# Altium schematic sheet pi_connectors.SchDoc
size A; SheetNumber: 2; SheetTotal: 2
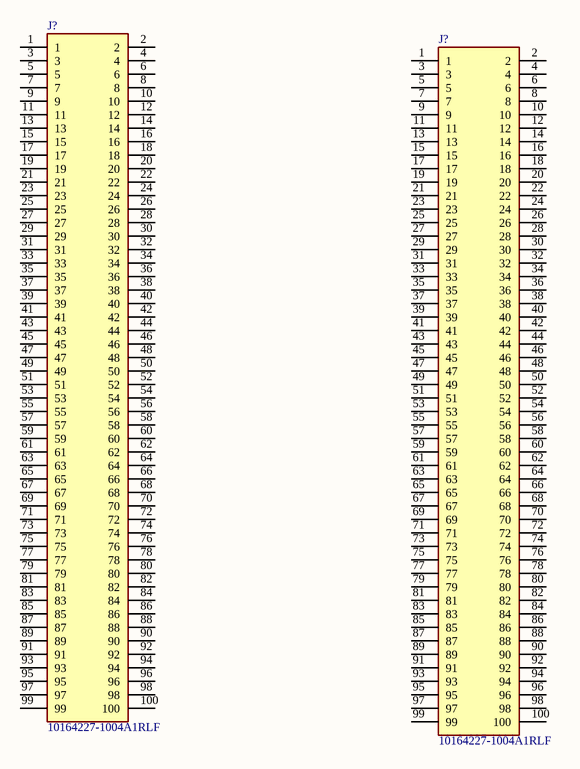
[diagram p0: pi_connectors.SchDoc]

## Parts
(Parts that share a designator on the sheet are numbered #1, #2 ... from top to bottom, then left to right.)
J?#1  10164227-1004A1RLF  [101642271004A1RLF]
J?#2  10164227-1004A1RLF  [101642271004A1RLF]

## Nets

Not connected (* = marked no-connect by the designer): J?#1 1 2 3 4 5 6 7 8 9 10 11 12 13 14 15 16 17 18 19 20 21 22 23 24 25 26 27 28 29 30 31 32 33 34 35 36 37 38 39 40 41 42 43 44 45 46 47 48 49 50 51 52 53 54 55 56 57 58 59 60 61 62 63 64 65 66 67 68 69 70 71 72 73 74 75 76 77 78 79 80 81 82 83 84 85 86 87 88 89 90 91 92 93 94 95 96 97 98 99 100; J?#2 1 2 3 4 5 6 7 8 9 10 11 12 13 14 15 16 17 18 19 20 21 22 23 24 25 26 27 28 29 30 31 32 33 34 35 36 37 38 39 40 41 42 43 44 45 46 47 48 49 50 51 52 53 54 55 56 57 58 59 60 61 62 63 64 65 66 67 68 69 70 71 72 73 74 75 76 77 78 79 80 81 82 83 84 85 86 87 88 89 90 91 92 93 94 95 96 97 98 99 100

## Library data of the parts
J?#1 J?#2 = 10164227-1004A1RLF: Connector; Manufacturer_Name: Amphenol; Description: BergStak 0.40mm; Datasheet Link: https://cdn.amphenol-cs.com/media/wysiwyg/files/drawing/10164227.pdf; Height: 4.1mm; Manufacturer_Part_Number: 10164227-1004A1RLF; Mouser Part Number: 649-101642271004RLF; Mouser Price/Stock: https://www.mouser.co.uk/ProductDetail/Amphenol-FCI/10164227-1004A1RLF?qs=T%252BzbugeAwjgkdT9HF7lYAw%3D%3D